# EAGLE design Simple USB SC Interface (EAGLE 8.5.2)
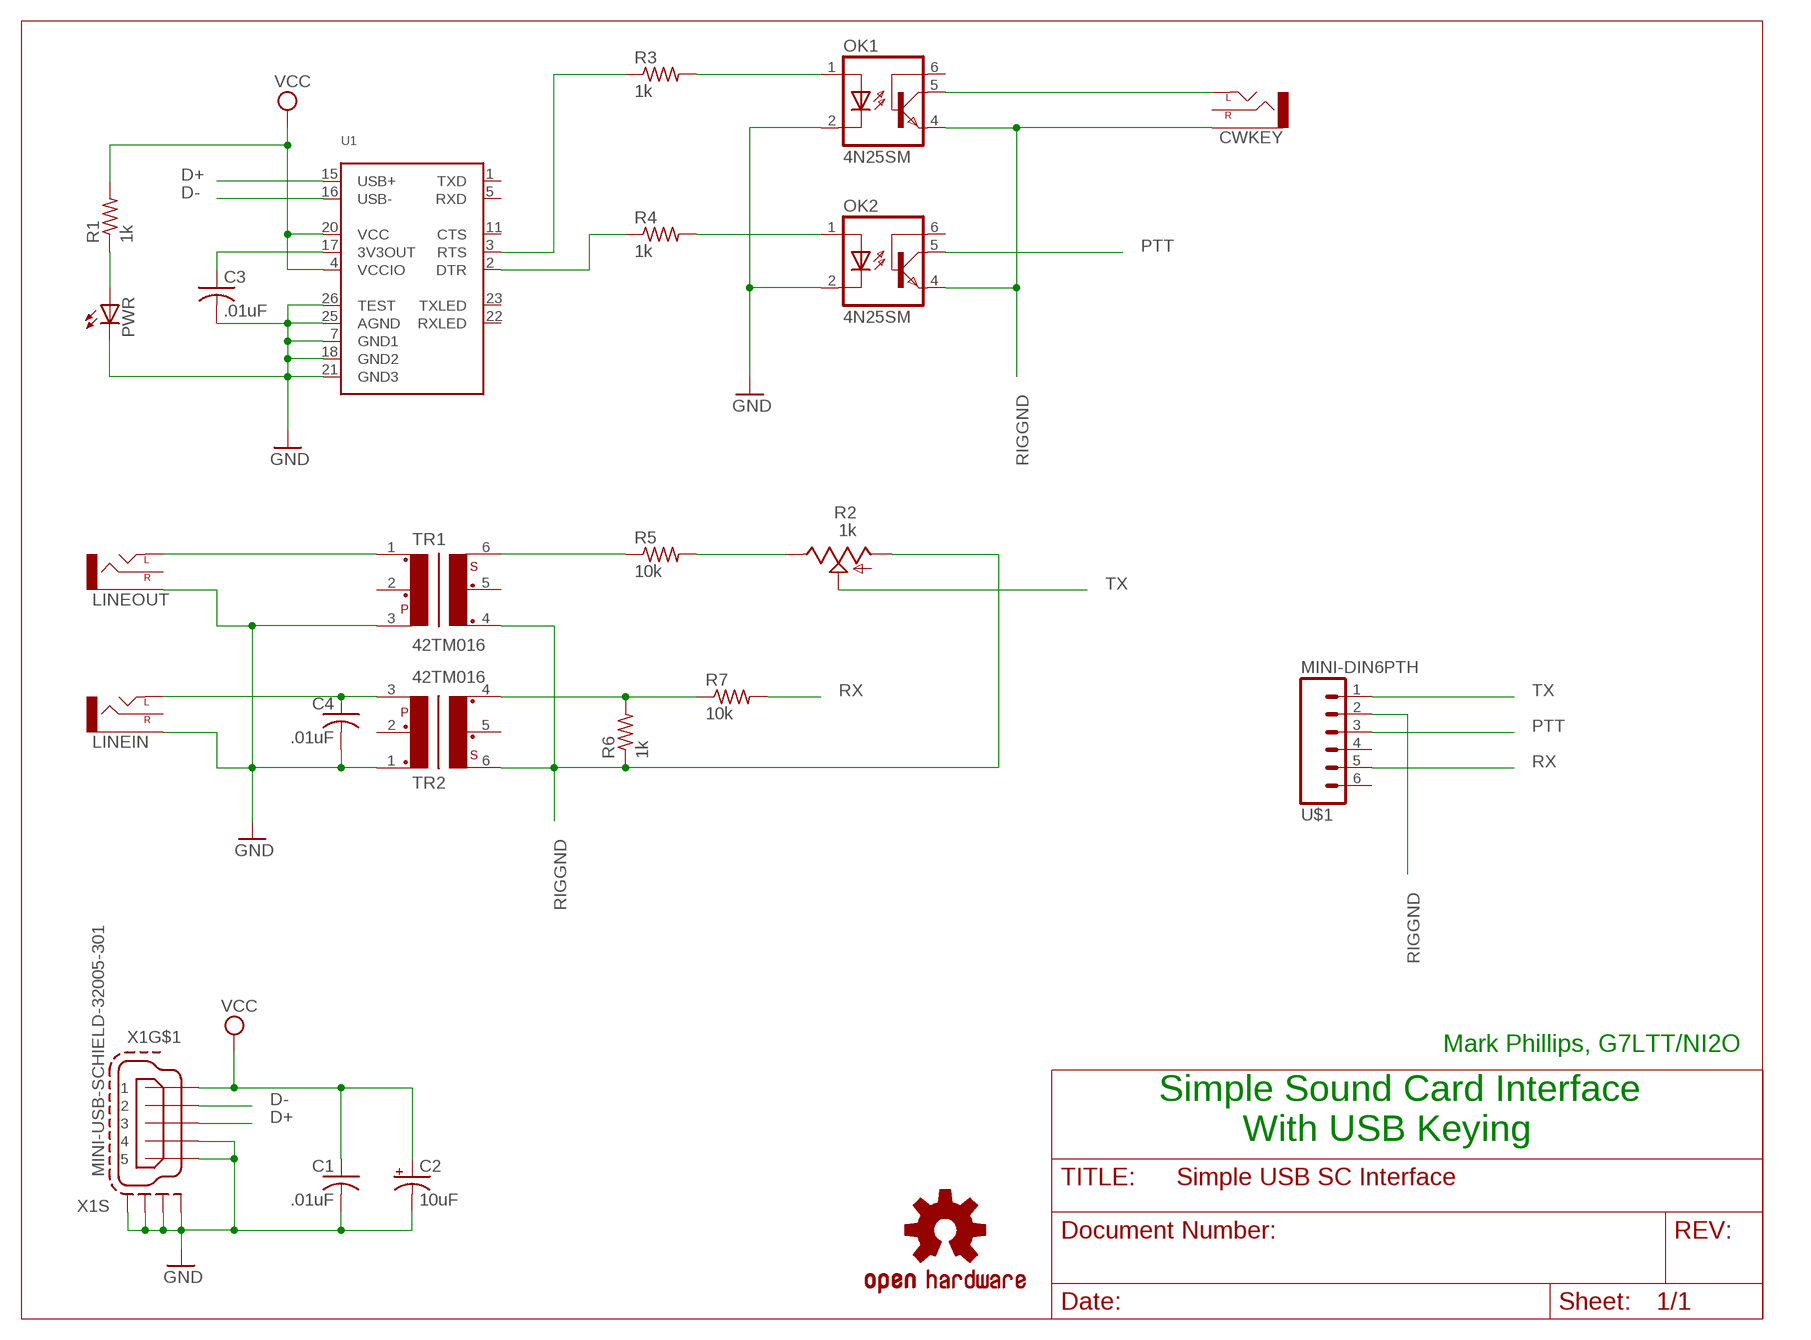
[diagram p0: schematic, sheet 1]

## Parts
C1  .01uF  C-USC0805  [C0805]
C2  10uF  CPOL-USE2.5-5  [E2,5-5]
C3  .01uF  C-USC0805  [C0805]
C4  .01uF  C-USC0805  [C0805]
CWKEY  AUDIO-JACKSMD2  [AUDIO-JACK-3.5MM-SMD]
LINEIN  AUDIO-JACKSMD2  [AUDIO-JACK-3.5MM-SMD]
LINEOUT  AUDIO-JACKSMD2  [AUDIO-JACK-3.5MM-SMD]
LOGO1  OSHW-LOGOM  [OSHW-LOGO-M]
OK1  4N25SM  [DIL6-SMD]
OK2  4N25SM  [DIL6-SMD]
PWR  LEDCHIP-LED0805  [CHIP-LED0805]
R1  1k  R-US_M0805  [M0805]
R2  1k  TRIM_US-CA6V  [CA6V]
R3  1k  R-US_M0805  [M0805]
R4  1k  R-US_M0805  [M0805]
R5  10k  R-US_M0805  [M0805]
R6  1k  R-US_M0805  [M0805]
R7  10k  R-US_M0805  [M0805]
TR1  42TM016  [42TM]
TR2  42TM016  [42TM]
U1  FT232RLSSOP28  [SSOP28DB]
U$1  MINI-DIN6PTH  [MINI-DIN6]
X1  MINI-USB-SCHIELD-32005-301  [32005-301]

## Nets
CWKEY: CWKEY.TIP(LEFT) OK1.5(COL)
D+: U1.15(USB+) X1.3
D-: U1.16(USB-) X1.2
GND: C1.2 C2.- C3.2 C4.2 LINEIN.SLEEVE LINEOUT.SLEEVE OK1.2(C) OK2.2(C) PWR.C TR1.3 TR2.1 U1.7(GND1) U1.18(GND2) U1.21(GND3) U1.25(AGND) U1.26(TEST) X1.4 X1.5 X1.M1(S:S1) X1.M2(S:S2) X1.M3(S:S3) X1.M4(S:S4)
N$1: PWR.A R1.1
N$2: OK1.1(A) R3.2
N$3: C3.1 U1.17(3V3OUT)
N$4: OK2.1(A) R4.2
N$5: R3.1 U1.3(RTS)
N$6: R4.1 U1.2(DTR)
N$7: C4.1 LINEIN.TIP(LEFT) TR2.3
N$8: LINEOUT.TIP(LEFT) TR1.1
N$9: R5.1 TR1.6
N$10: R2.E R5.2
N$11: R6.2 R7.1 TR2.4
PTT: OK2.5(COL) U$1.3
RIGGND: CWKEY.SLEEVE OK1.4(EMI) OK2.4(EMI) R2.A R6.1 TR1.4 TR2.6 U$1.2
RX: R7.2 U$1.5
TX: R2.S U$1.1
VCC: C1.1 C2.+ R1.2 U1.4(VCCIO) U1.20(VCC) X1.1
Unconnected: CWKEY.RING(RIGHT) LINEIN.RING(RIGHT) LINEOUT.RING(RIGHT) OK1.6(BAS) OK2.6(BAS) TR1.2 TR1.5 TR2.2 TR2.5 U1.1(TXD) U1.5(RXD) U1.11(CTS) U1.22(RXLED) U1.23(TXLED) U$1.4 U$1.6

## Notes on the sheet
- Mark Phillips, G7LTT/NI2O
- Simple Sound Card Interface
          With USB Keying

## Library data of the parts
C1 C3 C4 = rcl:C-US: CAPACITOR, American symbol
C2 = rcl:CPOL-US: POLARIZED CAPACITOR, American symbol
CWKEY LINEIN LINEOUT = SparkFun-Connectors:AUDIO-JACK: 3.5mm Audio Jack Simple 3.5mm common PCB mount audio jack. SKU: PRT-08032
LOGO1 = SparkFun-Aesthetics:OSHW-LOGO: Open Source Hardware Logo This logo indicates the piece of hardware it is found on incorporates a OSHW license and/or adheres to the definition of open source hardware found here: http://freedomdefined.org/OSHW
OK1 OK2 = optocoupler:4N*?M: General Purpose 6-Pin Phototransistor Optocouplers Source: http://www.fairchildsemi.com/ds/4N/4N35-M.pdf; MF: FAIRCHILD SEMICONDUCTOR; MPN: 4N25SM; OC_FARNELL: 1021152; OC_NEWARK: 34C2020
PWR = led:LED: LED OSRAM: - CHIPLED LG R971, LG N971, LY N971, LG Q971, LY Q971, LO R971, LY R971 LH N974, LH R974 LS Q976, LO Q976, LY Q976 LO Q996 - Hyper CHIPLED LW Q18S LB Q993, LB Q99A, LB R99A - SideLED LS A670, LO A670, LY A670, LG A670, LP A670 LB A673, LV A673, LT A673, LW A673 LH A674 LY A675 LS A676, LA A676, LO A676, LY A676, LW A676 LS A679, LY A679, LG A679 - Hyper Micro SIDELED® LS Y876, LA Y876, LO Y876, LY Y876 LT Y87S - SmartLED LW L88C, LW L88S LB L89C, LB L89S, LG L890 LS L89K, LO L89K, LY L89K LS L896, LA L896, LO L896, LY L896 - TOPLED LS T670, LO T670, LY T670, LG T670, LP T670 LSG T670, LSP T670, LSY T670, LOP T670, LYG T670 LG T671, LOG T671, LSG T671 LB T673, LV T673, LT T673, LW T673 LH T674 LS T676, LA T676, LO T676, LY T676, LB T676, LH T676, LSB T676, LW T676 LB T67C, LV T67C, LT T67C, LS T67K, LO T67K, LY T67K, LW E67C LS E67B, LA E67B, LO E67B, LY E67B, LB E67C, LV E67C, LT E67C LW T67C LS T679, LY T679, LG T679 LS T770, LO T770, LY T770, LG T770, LP T770 LB T773, LV T773, LT T773, LW T773 LH T774 LS E675, LA E675, LY E675, LS T675 LS T776, LA T776, LO T776, LY T776, LB T776 LHGB T686 LT T68C, LB T68C - Hyper Mini TOPLED® LB M676 - Mini TOPLED Santana® LG M470 LS M47K, LO M47K, LY M47K Source: http://www.osram.convergy.de LUXEON: - LUMILED® LXK2-PW12-R00, LXK2-PW12-S00, LXK2-PW14-U00, LXK2-PW14-V00 LXK2-PM12-R00, LXK2-PM12-S00, LXK2-PM14-U00 LXK2-PE12-Q00, LXK2-PE12-R00, LXK2-PE12-S00, LXK2-PE14-T00, LXK2-PE14-U00 LXK2-PB12-K00, LXK2-PB12-L00, LXK2-PB12-M00, LXK2-PB14-N00, LXK2-PB14-P00, LXK2-PB14-Q00 LXK2-PR12-L00, LXK2-PR12-M00, LXK2-PR14-Q00, LXK2-PR14-R00 LXK2-PD12-Q00, LXK2-PD12-R00, LXK2-PD12-S00 LXK2-PH12-R00, LXK2-PH12-S00 LXK2-PL12-P00, LXK2-PL12-Q00, LXK2-PL12-R00 Source: www.luxeon.com KINGBRIGHT: KA-3528ASYC Source: www.kingbright.com
R1 R3-R7 = rcl:R-US_: RESISTOR, American symbol
R2 = pot:TRIM_US-: POTENTIOMETER
TR1 TR2 = trafo-xicon:42T?*: Xicon Micro-Mini EI-12 Audio Transformers 42TL/42TC/42TM Series Source: http://www.mouser.com//catalog/specsheets/164201.pdf http://www.mouser.com/catalog/specsheets/114225.pdf http://www.mouser.com/catalog/specsheets/164267.pdf; OC_FARNELL: unknown; OC_NEWARK: unknown
U1 = microbuilder:FT232RL: FTDI FT232RL USB TO RS232 Converter Digikey: 768-1007-1-ND
U$1 = SparkFun-Connectors:MINI-DIN6: mini DIN 6 Connector Commonly found on the back of a computer for PS2 keyboard and mice. Schematic and footprint are proven. Spark Fun Electronics SKU : PRT-08509
X1 = con-cypressindustries:MINI-USB-SCHIELD-: MINI USB-B Conector Source: www.cypressindustries.com; OC_FARNELL: unknown; OC_NEWARK: unknown

## Board
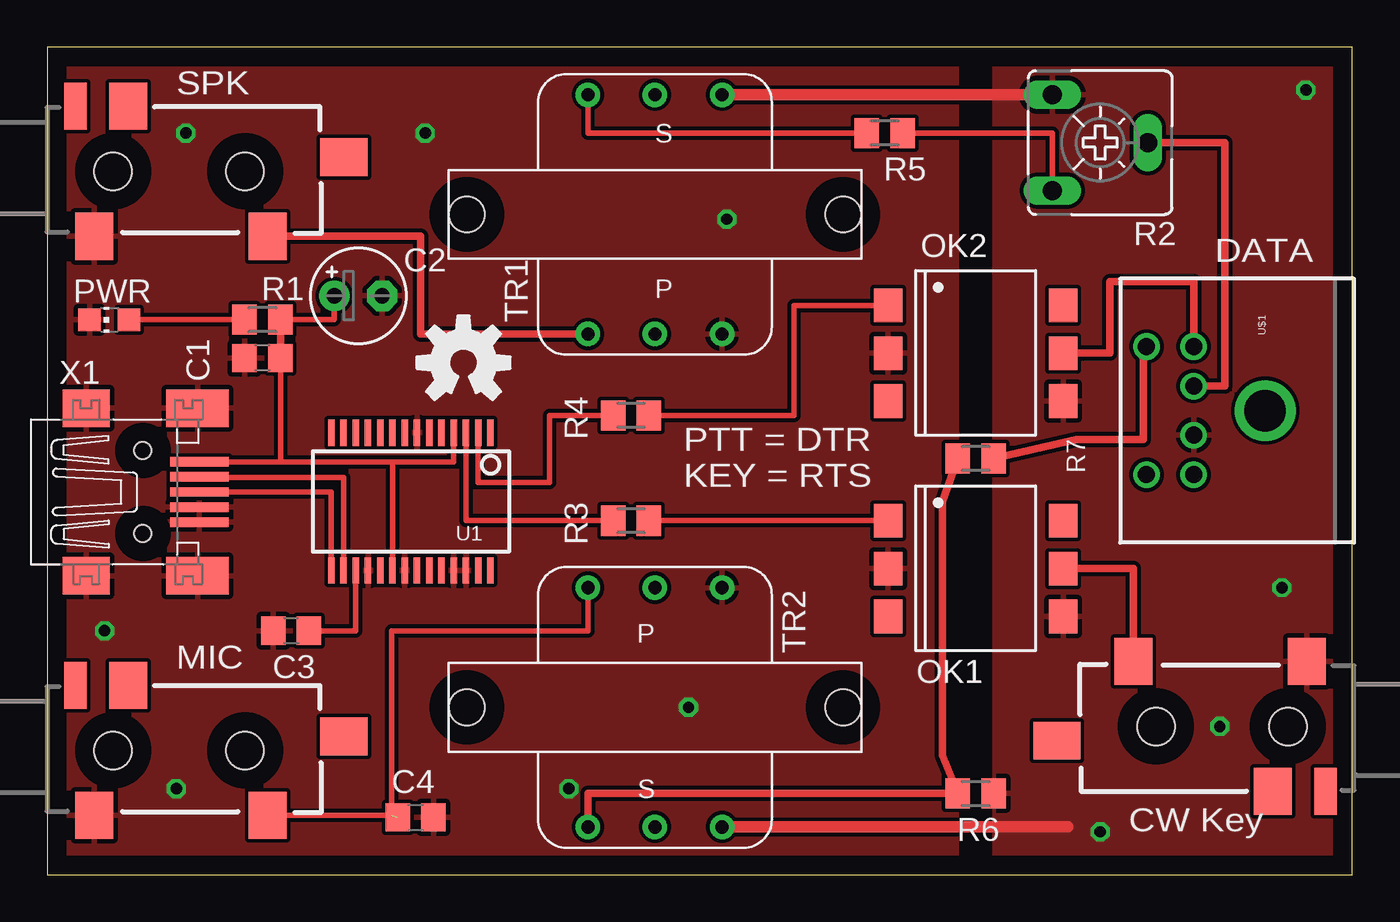
[diagram p1: board, top side]
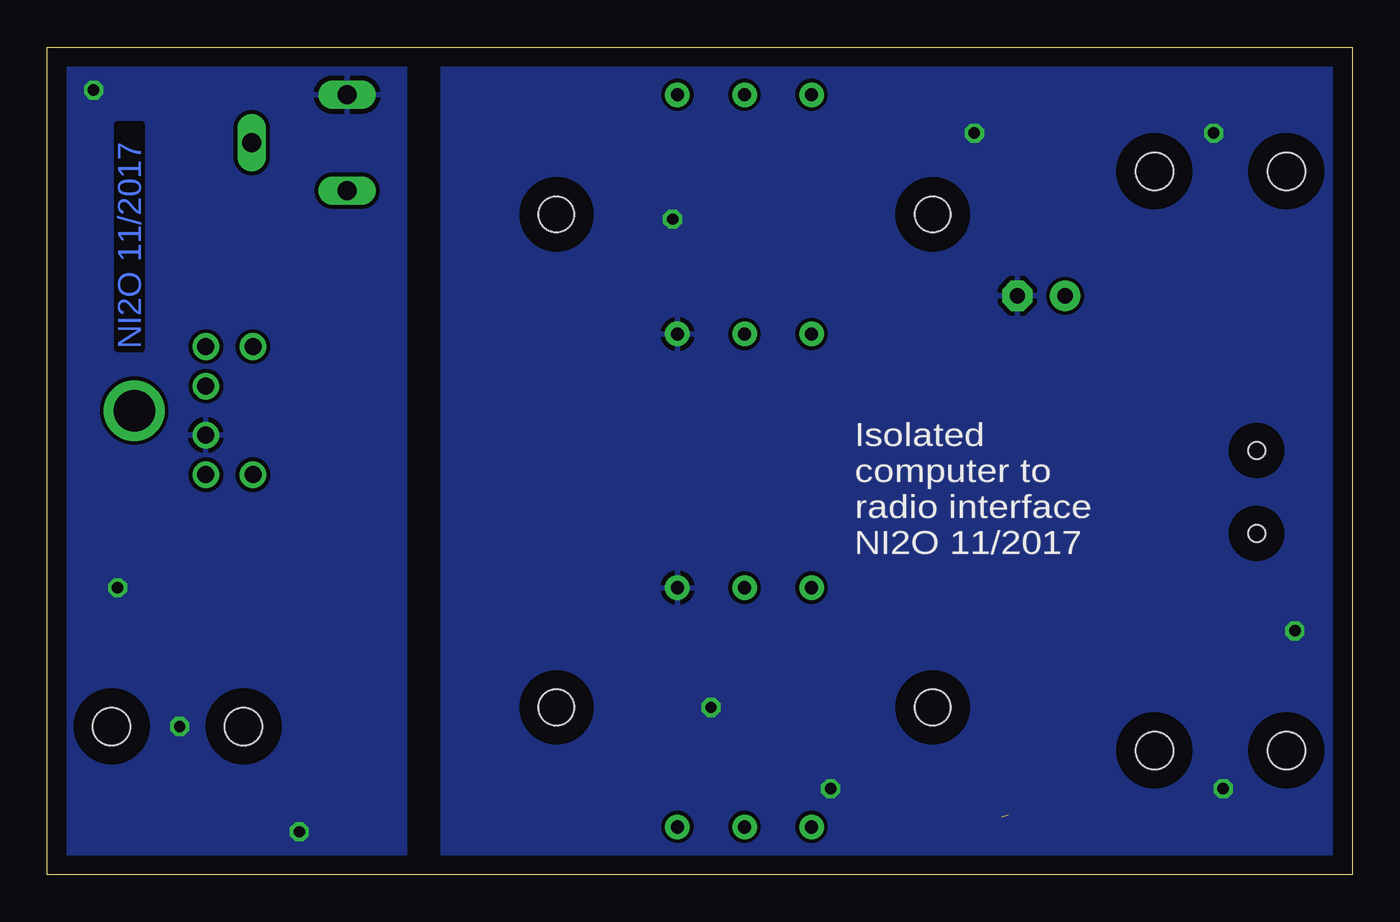
[diagram p2: board, bottom side, seen from below]

Size 69.27 x 43.93 mm. Coordinates in mm from the lower left corner, seen from the top.
Outline: 0,0 69.27,0 69.27,43.93 0,43.93 0,0
Copper layers (1*16): Top 0.035mm / dielectric 1.5mm / Bottom 0.035mm
Design rules "default": minimum track width 10mil, minimum drill 24mil, track to track 8mil, track to pad 8mil, pad to pad 8mil, via to via 8mil, smd to smd 8mil, copper to edge 40mil, drill to drill 8mil, minimum pad ring 10mil, minimum via ring 8mil, stop-mask expansion 4mil, vias tented up to drill 0mil, thermal gap 10mil

### Footprints (pad centres in the part's own frame; a part is rotated, then mirrored left to right if it is on the bottom)
C0805 = smd 1.3 x 1.5: 1 -0.95,0; 2 0.95,0
E2,5-5 = drill 0.813 pad 1.6: + -1.27,0 | drill 0.813 pad 1.6 octagon: - 1.27,0
AUDIO-JACK-3.5MM-SMD = smd 2 x 2.5: RING 4.3,3.45; SLEEVE 2.5,-3.45; TIP 11.7,-3.45 | smd 1.2 x 2.5: RSH 1.5,3.45 | smd 2.5 x 2: TSH 15.75,0.75 | hole 2: 3.5,0; 10.5,0
DIL6-SMD = smd 1.78 x 1.52: 1 -2.54,-4.645; 2 0,-4.645; 3 2.54,-4.645; 4 2.54,4.645; 5 0,4.645; 6 -2.54,4.645
CHIP-LED0805 = smd 1.2 x 1.2: A 0,-1.05; C 0,1.05
M0805 = smd 1.3 x 1.6: 1 -0.95,0; 2 0.95,0
CA6V = drill 1.016 long: A -2.54,-2.54; E 2.54,-2.54; S 0,2.54
42TM = drill 0.7 pad 1.3: 1 -3.556,-6.35; 2 0,-6.35; 3 3.556,-6.35; 4 3.556,6.35; 5 0,6.35; 6 -3.556,6.35 | hole 1.9: -9.982,0; 9.982,0
SSOP28DB = smd 0.348 x 1.397: 1 -4.225,-3.656; 2 -3.575,-3.656; 3 -2.925,-3.656; 4 -2.275,-3.656; 5 -1.625,-3.656; 6 -0.975,-3.656; 7 -0.325,-3.656; 8 0.325,-3.656; 9 0.975,-3.656; 10 1.625,-3.656; 11 2.275,-3.656; 12 2.925,-3.656; 13 3.575,-3.656; 14 4.225,-3.656; 15 4.225,3.656; 16 3.575,3.656; 17 2.925,3.656; 18 2.275,3.656; 19 1.625,3.656; 20 0.975,3.656; 21 0.325,3.656; 22 -0.325,3.656; 23 -0.975,3.656; 24 -1.625,3.656; 25 -2.275,3.656; 26 -2.925,3.656; 27 -3.575,3.656; 28 -4.225,3.656
MINI-DIN6 = drill 0.9: 1 -1.3,-8.5; 2 1.3,-8.5; 3 -3.4,-8.5; 4 3.4,-8.5; 5 -3.4,-11; 6 3.4,-11 | drill 2.2: P$1 0,-4.7
32005-301 = smd 3.1 x 0.5: 1 3,1.6; 2 3,0.8; 3 3,0; 4 3,-0.8; 5 3,-1.6 | smd 2.5 x 2: M1 -3,-4.45; M2 -3,4.45 | smd 3.3 x 2: M3 2.9,4.45; M4 2.9,-4.45 | hole 0.9: 0,2.2; 0,-2.2

### Placement (x,y rotation side)
C1  11.43,27.43 180 top
C2  16.51,30.73 0 top
C3  12.95,12.95 180 top
C4  19.56,3.05 0 top
CWKEY  69.34,7.87 180 top
LINEIN  0,6.6 0 top
LINEOUT  0,37.34 0 top
LOGO1  22.1,27.18 0 top
OK1  49.28,16.26 270 top
OK2  49.28,27.69 270 top
PWR  3.3,29.46 90 top
R1  11.43,29.46 0 top
R2  55.88,38.86 270 top
R3  30.99,18.8 0 top
R4  30.99,24.38 0 top
R5  44.45,39.37 0 top
R6  49.28,4.32 180 top
R7  49.28,22.1 0 top
TR1  32.26,35.05 0 top
TR2  32.26,8.89 180 top
U1  19.3,19.81 180 top
U$1  69.34,24.64 270 top
X1  5.08,20.32 0 top

### Tracks (layer width: path | path; a pad name or v marks a point on that pad's centre or on a via)
CWKEY
  Top 0.406: OK1.5 57.64,16.26 CWKEY.TIP
D+
  Top 0.305: X1.3 15.08,20.32 U1.15
D-
  Top 0.305: U1.16 15.75,16.16 15.75,21.08 8.08,21.08 X1.2
GND  (via drill 0.6)
  other vias: 7.37,39.37 6.86,4.57 36.07,34.8 34.04,8.89 3.05,12.95 20.07,39.37 27.69,4.57
  pour Top: 0,0 48.26,0 48.26,43.94 0,43.94
  pour Bottom: 0,0 48.26,0 48.26,43.94 0,43.94
N$1
  Top 0.305: PWR.A R1.1
N$2
  Top 0.305: R3.2 OK1.1
N$3
  Top 0.305: C3.1 16.38,12.95 U1.17
N$4
  Top 0.305: R4.2 39.62,24.38 39.62,30.23 OK2.1
N$5
  Top 0.305: R3.1 22.23,18.8 U1.3
N$6
  Top 0.305: R4.1 26.67,24.38 26.67,20.83 22.88,20.83 U1.2
N$7  (1 unrouted)
  Top 0.305: LINEIN.TIP 18.29,3.15 18.29,12.95 28.7,12.95 TR2.3
N$8
  Top 0.406: LINEOUT.TIP 19.81,33.89 19.81,28.7 TR1.1
N$9
  Top 0.305: TR1.6 28.7,39.37 R5.1
N$10
  Top 0.305: R5.2 53.34,39.37 R2.E
N$11
  Top 0.406: TR2.4 28.7,4.32 R6.2 47.5,6.35 47.5,19.81 R7.1
PTT
  Top 0.406: U$1.3 60.84,31.5 56.39,31.5 56.39,27.69 OK2.5
RIGGND  (via drill 0.6)
  Top 0.61: TR2.6 54.17,2.54 | TR1.4 R2.A
  other vias: 62.23,7.87 66.8,41.66 65.53,15.24 55.88,2.29
  pour Top: 50.29,43.94 69.34,43.94 69.34,0 50.29,0
  pour Bottom: 69.34,0 69.34,43.94 50.29,43.94 50.29,0
RX
  Top 0.406: U$1.5 58.17,28.04 58.17,23.11 54.61,23.11 R7.2
TX
  Top 0.406: U$1.1 62.48,25.94 62.48,38.86 R2.S
VCC
  Top 0.305: 18.33,21.92 21.58,21.92 U1.4 | X1.1 12.19,21.92 12.38,21.92 | 12.38,21.92 18.33,21.92 | 18.33,21.92 U1.20 | R1.2 15.24,29.46 C2.+ | C1.1 12.38,21.92
  Top 0.406: R1.2 C1.1

### Text on the board
Bottom: NI2O 11/2017
tPlace: SPK | DATA | PTT = DTR / KEY = RTS | MIC | CW Key
bPlace: Isolated / computer to / radio interface / NI2O 11/2017